# EAGLE design keyboard (EAGLE 6.6.0)
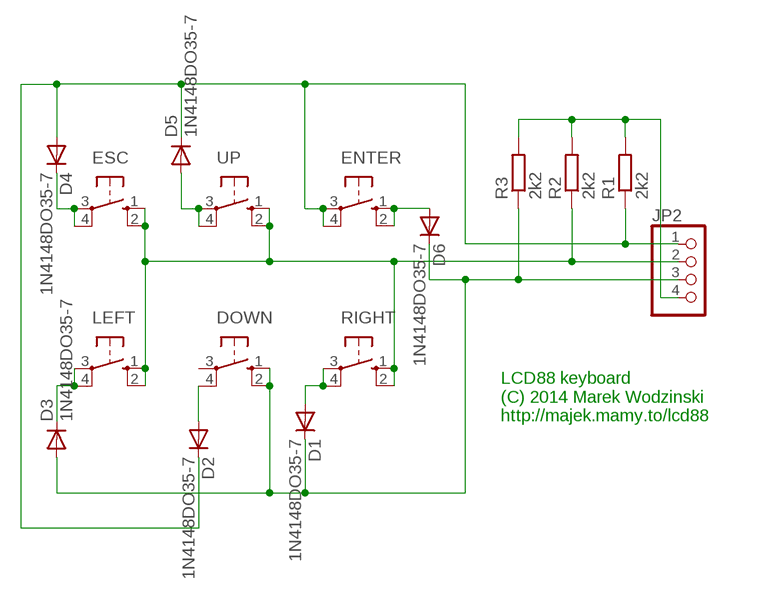
[diagram p0: schematic, sheet 1]

## Parts
D1  1N4148DO35-7  [DO35-7]
D2  1N4148DO35-7  [DO35-7]
D3  1N4148DO35-7  [DO35-7]
D4  1N4148DO35-7  [DO35-7]
D5  1N4148DO35-7  [DO35-7]
D6  1N4148DO35-7  [DO35-7]
DOWN  10-XX  [B3F-10XX]
ENTER  10-XX  [B3F-10XX]
ESC  10-XX  [B3F-10XX]
JP2  PINHD-1X4  [1X04]
LEFT  10-XX  [B3F-10XX]
R1  2k2  R-EU_R0805W  [R0805W]
R2  2k2  R-EU_R0805W  [R0805W]
R3  2k2  R-EU_R0805W  [R0805W]
RIGHT  10-XX  [B3F-10XX]
UP  10-XX  [B3F-10XX]

## Nets
N$2: ESC.1(S) ESC.2(S1) JP2.2 LEFT.1(S) LEFT.2(S1) R2.1 RIGHT.1(S) RIGHT.2(S1) UP.1(S) UP.2(S1)
N$3: D2.A DOWN.4(P1)
N$4: D4.C ESC.3(P) ESC.4(P1)
N$5: D5.A UP.3(P) UP.4(P1)
N$6: D2.C D4.A D5.C ENTER.3(P) ENTER.4(P1) JP2.1 R1.1
N$8: D6.A ENTER.1(S) ENTER.2(S1)
N$9: D3.C LEFT.3(P) LEFT.4(P1)
N$10: D1.A RIGHT.3(P) RIGHT.4(P1)
N$11: D1.C D3.A D6.C DOWN.1(S) DOWN.2(S1) JP2.3 R3.1
PLUS: JP2.4 R1.2 R2.2 R3.2
Unconnected: DOWN.3(P)

## Notes on the sheet
- LCD88 keyboard
  (C) 2014 Marek Wodzinski
  http://majek.mamy.to/lcd88

## Library data of the parts
D1-D6 = diode:1N4148: DIODE high speed (Philips)
DOWN ENTER ESC LEFT RIGHT UP = switch-omron:10-XX: OMRON SWITCH
JP2 = pinhead:PINHD-1X4: PIN HEADER
R1-R3 = rcl:R-EU_: RESISTOR, European symbol

## Board
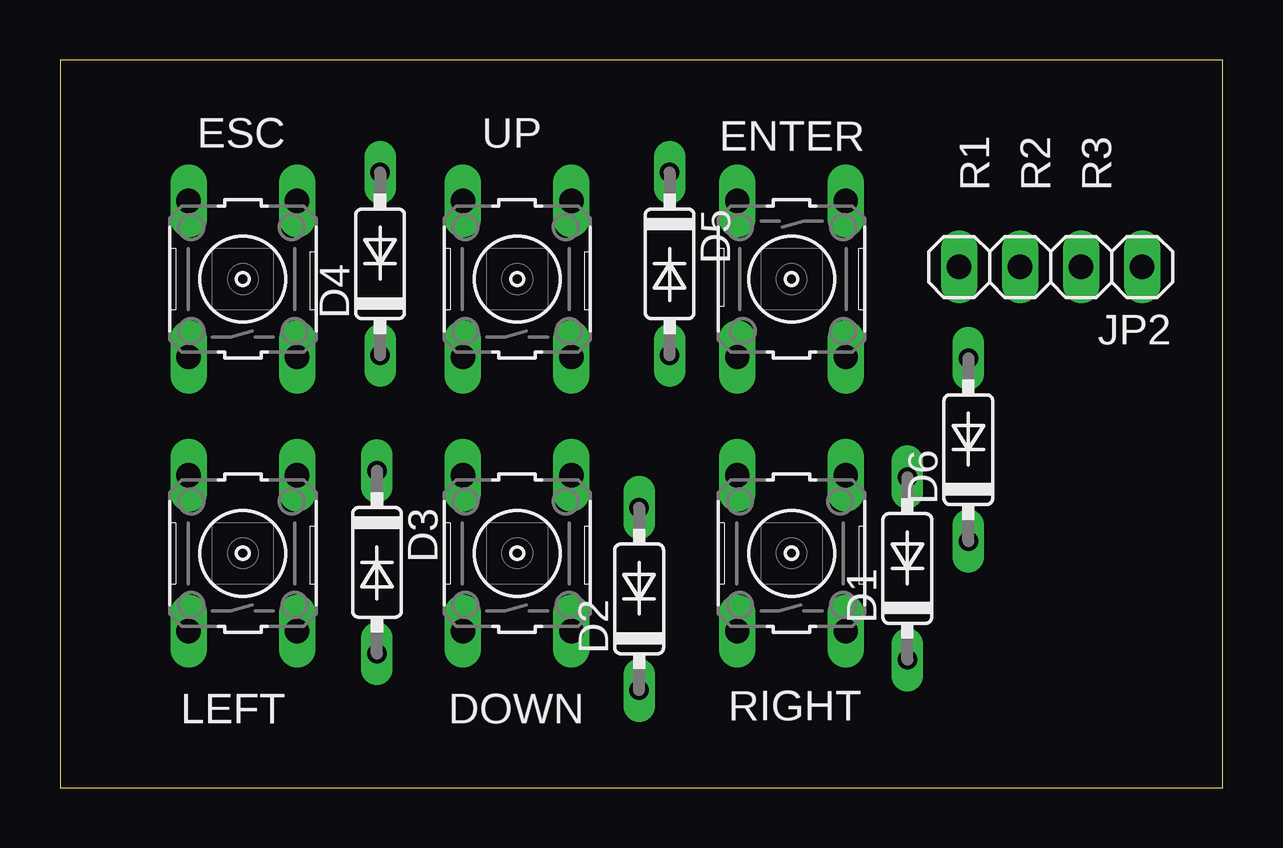
[diagram p1: board, top side]
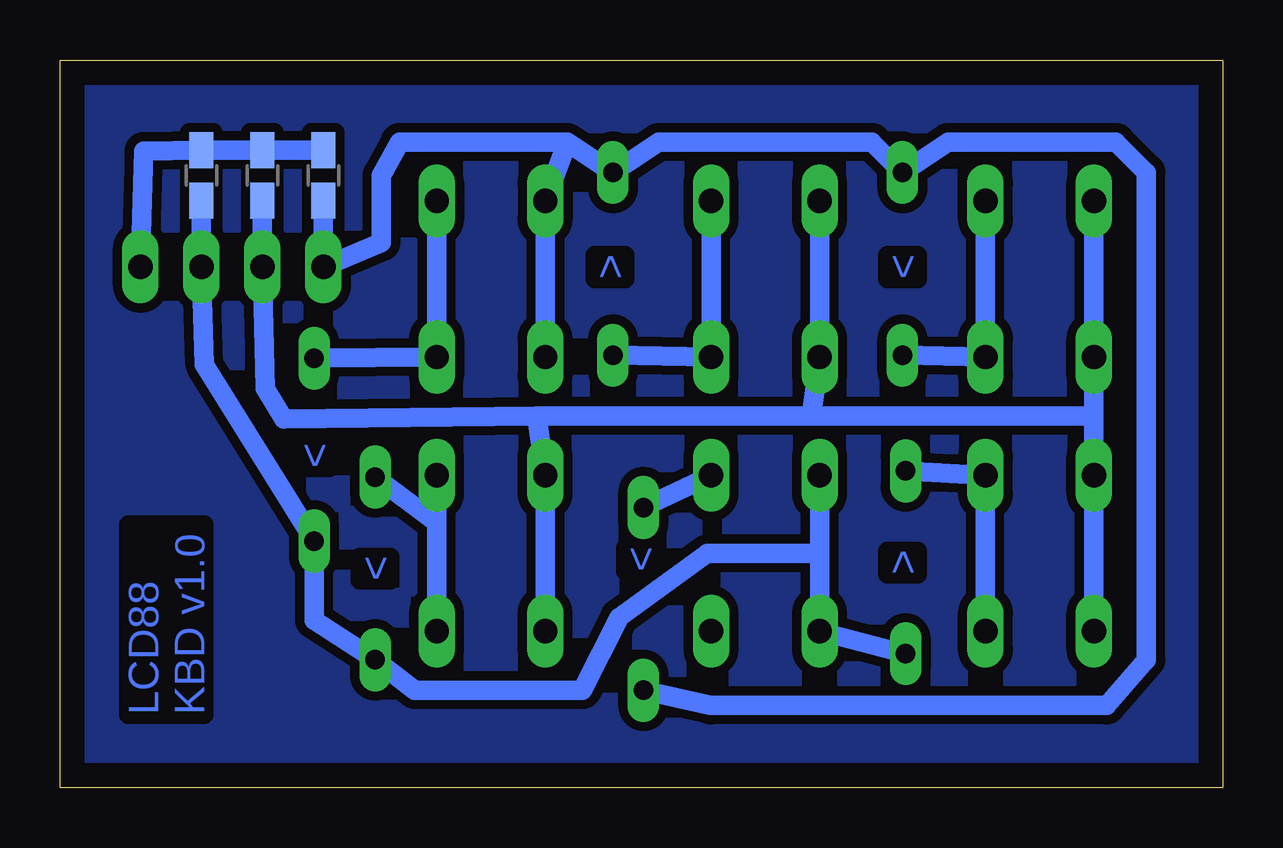
[diagram p2: board, bottom side, seen from below]

Size 48.44 x 30.34 mm. Coordinates in mm from the lower left corner, seen from the top.
Outline: 0,0 48.44,0 48.44,30.34 0,30.34 0,0
Copper layers (1*16): Top 0.035mm / dielectric 1.5mm / Bottom 0.035mm
Design rules "default *": minimum track width 10mil, minimum drill 24mil, track to track 15mil, track to pad 15mil, pad to pad 8mil, via to via 8mil, smd to smd 8mil, copper to edge 40mil, drill to drill 8mil, minimum pad ring 10mil, minimum via ring 8mil, stop-mask expansion 4mil, vias tented up to drill 0mil, thermal gap 10mil

### Footprints (pad centres in the part's own frame; a part is rotated, then mirrored left to right if it is on the bottom)
DO35-7 = drill 0.813 long: A 3.81,0; C -3.81,0
B3F-10XX = drill 1.016 long: 1 -3.251,2.261; 2 3.251,2.261; 3 -3.251,-2.261; 4 3.251,-2.261
1X04 = drill 1.016 long: 1 -3.81,0; 2 -1.27,0; 3 1.27,0; 4 3.81,0
R0805W = smd 1.5 x 1: 1 -1.052,0; 2 1.052,0

### Placement (x,y rotation side)
D1  35.31,9.14 90 top
D2  24.13,7.87 90 top
D3  13.21,9.4 270 top
D4  13.34,21.84 90 top
D5  25.4,21.84 270 top
D6  37.85,14.1 90 top
DOWN  19.05,9.78 90 top
ENTER  30.48,21.21 270 top
ESC  7.62,21.21 90 top
JP2  41.27,21.72 0 top
LEFT  7.62,9.78 90 top
R1  37.46,25.53 90 bottom
R2  40,25.53 90 bottom
R3  42.54,25.53 90 bottom
RIGHT  30.48,9.78 90 top
UP  19.05,21.21 90 top

### Tracks (layer width: path | path; a pad name or v marks a point on that pad's centre or on a via)
N$1
  pour Bottom: 0.51,29.72 0.64,0.51 47.75,0.64 47.75,29.72
N$2
  Bottom 0.813: 28.57,15.49 39.12,15.37 39.88,16.64 JP2.2 R2.1 | 28.57,15.49 RIGHT.2 RIGHT.1 | 17.14,15.49 UP.1 UP.2 | 17.14,15.49 28.57,15.49 | LEFT.1 LEFT.2 5.36,15.49 | 5.36,15.49 ESC.1 ESC.2 | 5.36,15.49 17.14,15.49
N$3
  Bottom 0.813: DOWN.4 D2.A
N$4
  Bottom 0.813: D4.C ESC.3 ESC.4
N$5
  Bottom 0.813: UP.4 UP.3 D5.A
N$6
  Bottom 0.813: 27.3,26.92 34.29,26.92 35.05,25.53 35.05,22.73 JP2.1 R1.1 | 27.3,26.92 D5.C 23.5,26.92 14.61,26.92 D4.A 11.43,26.92 4.45,26.92 3.18,25.65 3.18,5.33 4.83,3.43 21.34,3.43 D2.C | 27.3,26.92 ENTER.3 ENTER.4
N$8
  Bottom 0.813: ENTER.1 ENTER.2 D6.A
N$9
  Bottom 0.813: D3.C LEFT.4 LEFT.3
N$10
  Bottom 0.813: RIGHT.3 32.74,11.05 | 32.74,11.05 RIGHT.4 | 32.74,11.05 D1.A
N$11
  Bottom 0.813: 16.79,9.78 DOWN.1 D3.A | 16.79,9.78 DOWN.2 | 16.79,9.78 21.46,9.78 25.15,7.11 26.67,4.06 33.65,4.06 D1.C 37.85,6.99 D6.C 42.42,17.65 JP2.3 R3.1
PLUS
  Bottom 0.813: R1.2 R2.2 R3.2 44.96,26.54 JP2.4

### Text on the board
Bottom: < | > | < | > | < | < | LCD88 / KBD v1.0